# Altium schematic sheet BW1097_AV.SchDoc: =project_title
size Tabloid; CompanyName: Luxonis Holding; Organization: Luxonis Holding; Address1: 1925 Harmony Park Drive; Address2: Westminster, CO; Address3: 80234; Address4: United States; SheetNumber: 17; SheetTotal: 17
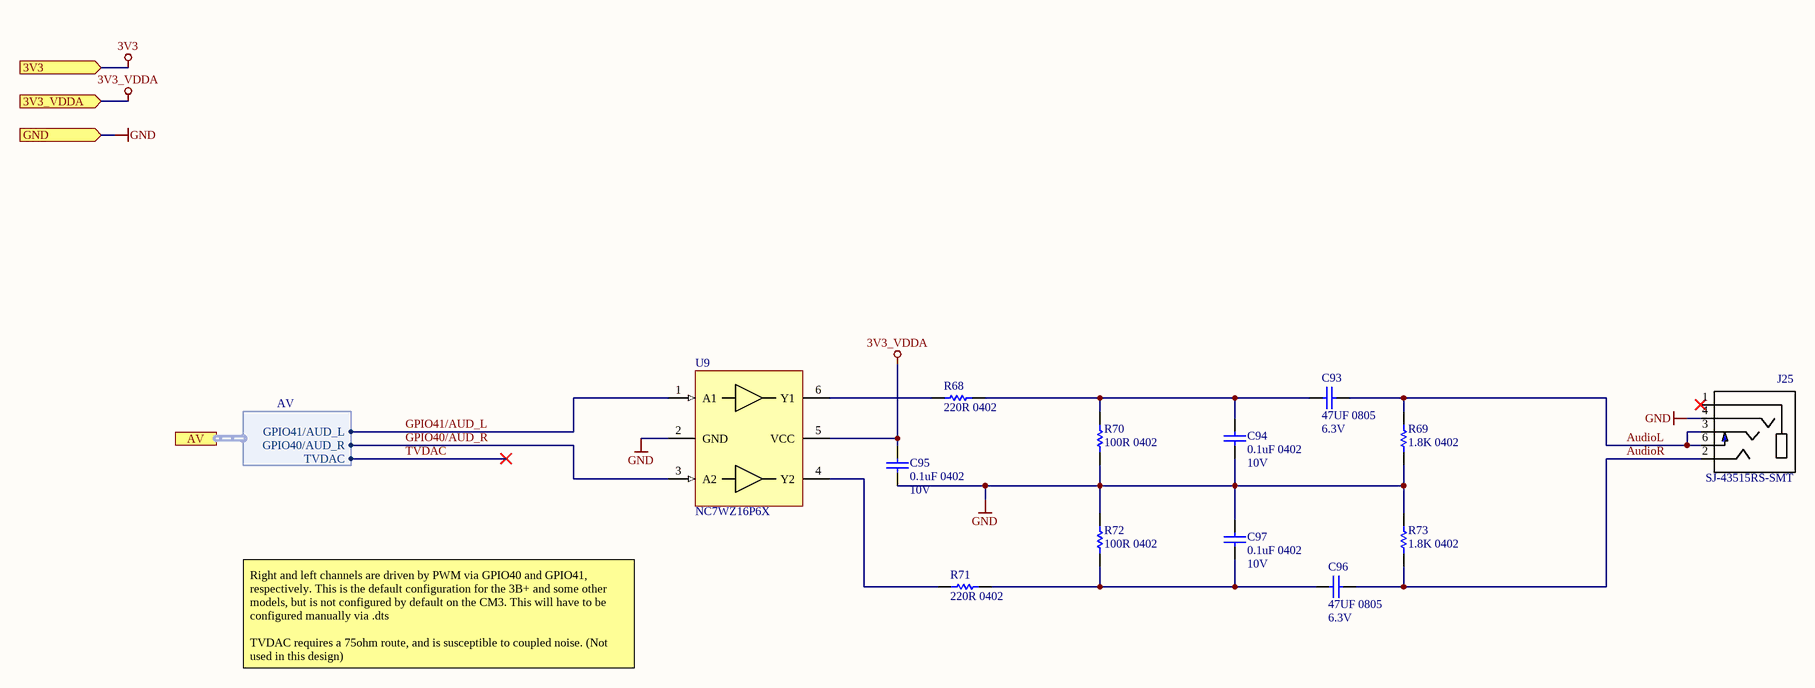
[diagram p0: BW1097_AV.SchDoc]

## Parts
C93  47UF 0805  Voltage: 6.3V  [CAPC0805(2012)145_N]
C94  0.1uF 0402  Voltage Rating: 10V  [CAPC0402(1005)70_N]
C95  0.1uF 0402  Voltage Rating: 10V  [CAPC0402(1005)70_N]
C96  47UF 0805  Voltage: 6.3V  [CAPC0805(2012)145_N]
C97  0.1uF 0402  Voltage Rating: 10V  [CAPC0402(1005)70_N]
J25  SJ-43515RS-SMT  [SJ-43515RS-SMT]
R68  220R 0402  [RESC0402(1005)_N]
R69  1.8K 0402  [RESC0402(1005)_N]
R70  100R 0402  [RESC0402(1005)_N]
R71  220R 0402  [RESC0402(1005)_N]
R72  100R 0402  [RESC0402(1005)_N]
R73  1.8K 0402  [RESC0402(1005)_N]
U9  NC7WZ16P6X  [NC7WZ16P6X]

## Ports
3V3 (in), 3V3_VDDA (in), AV (harness AV), GND (in)

## Harnesses
AV: GPIO40/AUD_R, GPIO41/AUD_L, TVDAC

## Nets
3V3: port 3V3
3V3_VDDA: C95.2 U9.5(VCC) ; port 3V3_VDDA
GND: C94.1 C95.1 C97.1 J25.4(RING2) R69.1 R70.1 R72.1 R73.1 U9.2(GND) ; port GND
AudioL: C93.1 J25.3(RING1) J25.6(RING_SWITCH) R69.2
AudioR: C96.1 J25.2(TIP) R73.2
GPIO40/AUD_R: U9.3(A2) ; port AV.GPIO40/AUD_R
GPIO41/AUD_L: U9.1(A1) ; port AV.GPIO41/AUD_L
TVDAC: port AV.TVDAC
NetC93_2: C93.2 C94.2 R68.2 R70.2
NetC96_2: C96.2 C97.2 R71.2 R72.2
NetR68_1: R68.1 U9.6(Y1)
NetR71_1: R71.1 U9.4(Y2)

Not connected (* = marked no-connect by the designer): J25 1(SLEEVE)*

## Notes on the sheet
- Right and left channels are driven by PWM via GPIO40 and GPIO41, respectively. This is the default configuration for the 3B+ and some other models, but is not configured by default on the CM3. This will have to be configured manually via .dts
  TVDAC requires a 75ohm route, and is susceptible to coupled noise. (Not used in this design)
- Title
- Size:
- Date:
- Tabloid
- Number:
- Time:
- Revision:
- Sheet
- of
- Drawn by:

## Library data of the parts
C93 C96 = GRM21BR60J476ME15L: CAP CER 47UF 6.3V X5R 0805; Manufacturer 1: Murata; Tolerance: 20%; Manufacturer Part Number 1: GRM21BR60J476ME15L; Supplier 1: Digi-Key; Stock 1: 16165; Pricing 1: 1=0.48000, 10=0.33900, 100=0.22360, 500=0.16560, 1000=0.14076 (USD); RoHS: Yes; Mount: Surface Mount; Case/Package: 0805; Weight: 0.000335oz; Case Code (Metric): 2012; Case Code (Imperial): 0805; Min Operating Temperature: -55°C; Max Operating Temperature: 85°C; Voltage Rating: 6.3V; Packaging: Tape and Reel; Capacitance: 47uF; Voltage Rating (DC): 6.3V; Package Quantity: 3000; Termination: SMD/SMT; Dielectric: X5R; Length: 2mm; Height: 1.25mm; Width: 0.049inch; Depth: 1.25mm; Thickness: 0.057inch; Lead Free: Lead Free; REACH SVHC: No SVHC; ComponentLink1URL: https://datasheet.ciiva.com/46444/1754700-46444997.pdf?src-supplier=Element14; ComponentLink1Description: https://datasheet.ciiva.com/46444/1754700-46444997.pdf?src-supplier=Element14; Supplier 2: Newark; Supplier 3: Mouser; Supplier Part Number 1: 490-9960-1-ND; Supplier Part Number 2: 40X5890; Supplier Part Number 3: 81-GRM21BR60J476ME5L
C94 C95 C97 = GRM155R71A104JA01D: CAP CER 0.1UF 10V X7R 0402 5%; Manufacturer 1: Murata; Capacitance: 100nF; Manufacturer Part Number 1: GRM155R71A104JA01D; Supplier 1: Digi-Key; Stock 1: 1346709; Pricing 1: 1=0.10000, 10=0.02500, 100=0.01130, 500=0.00806, 1000=0.00633, 2500=0.00575, 5000=0.00529 (USD); RoHS: Yes; Mount: Surface Mount; Case/Package: 0402; Case Code (Imperial): 0402; Case Code (Metric): 1005; Min Operating Temperature: -55°C; Max Operating Temperature: 125°C; Tolerance: 5%; Packaging: Tape and Reel; Voltage Rating (DC): 10V; Dielectric: X7R; Package Quantity: 10000; Termination: SMD/SMT; Length: 1mm; Height: 0.5mm; Width: 0.02inch; Thickness: 0.022inch; Depth: 0.5mm; Radiation Hardening: No; Lead Free: Lead Free; ComponentLink1URL: https://datasheet.ciiva.com/5411/product-5411135.pdf?src-supplier=Mouser; ComponentLink1Description: https://datasheet.ciiva.com/5411/product-5411135.pdf?src-supplier=Mouser; ComponentLink2URL: https://datasheet.ciiva.com/11618/c02e-11618821.pdf?src-supplier=Avnet; ComponentLink2Description: https://datasheet.ciiva.com/11618/c02e-11618821.pdf?src-supplier=Avnet; Supplier Part Number 1: 490-10777-1-ND
J25 = SJ-43515RS-SMT: CONN JACK 4COND 3.5MM SMD R/A; Manufacturer 1: CUI; Manufacturer Part Number 1: SJ-43515RS-SMT-TR; Gender: Female; Shielding: Unshielded; Number of Conductors: 4; Number of Ports: 1; Current Rating: 1A; Value: *; Supplier 1: Mouser; Stock 1: 7368; Pricing 1: 1=1.07000, 10=0.93900, 50=0.84700, 100=0.81000, 1000=0.58900, 10000=0.53400 (USD); Mount: Surface Mount; Case/Package: SMD/SMT; Color: Black; Contact Plating: Silver; Packaging: Tape and Reel; Connector Type: Jack; Orientation: Horizontal; Termination: Solder; ComponentLink1URL: https://datasheet.ciiva.com/7368/sj-4351x-smt-series-7368764.pdf?src-supplier=Digi-Key; ComponentLink1Description: https://datasheet.ciiva.com/7368/sj-4351x-smt-series-7368764.pdf?src-supplier=Digi-Key; ComponentLink2URL: https://datasheet.ciiva.com/7368/sj-4351x-smt-series-7368767.pdf?src-supplier=Digi-Key; ComponentLink2Description: https://datasheet.ciiva.com/7368/sj-4351x-smt-series-7368767.pdf?src-supplier=Digi-Key; ComponentLink3URL: http://datasheet.octopart.com/SJ-43515RS-SMT-TR-CUI-datasheet-103775270.pdf?src-supplier=CUI; ComponentLink3Description: http://datasheet.octopart.com/SJ-43515RS-SMT-TR-CUI-datasheet-103775270.pdf?src-supplier=CUI; ComponentLink4URL: http://datasheet.octopart.com/SJ-43515RS-SMT-TR-CUI-datasheet-136901581.pdf?src-supplier=CUI; ComponentLink4Description: http://datasheet.octopart.com/SJ-43515RS-SMT-TR-CUI-datasheet-136901581.pdf?src-supplier=CUI; ComponentLink5URL: http://datasheet.octopart.com/SJ-43515RS-SMT-TR-CUI-datasheet-103114024.pdf?src-supplier=Electro+Sonic; ComponentLink5Description: http://datasheet.octopart.com/SJ-43515RS-SMT-TR-CUI-datasheet-103114024.pdf?src-supplier=Electro+Sonic; ComponentLink6URL: http://datasheet.octopart.com/SJ-43515RS-SMT-TR-CUI-datasheet-13290545.pdf?src-supplier=Future+Electronics; ComponentLink6Description: http://datasheet.octopart.com/SJ-43515RS-SMT-TR-CUI-datasheet-13290545.pdf?src-supplier=Future+Electronics; ComponentLink7URL: http://datasheet.octopart.com/SJ-43515RS-SMT-TR-CUI-datasheet-102990244.pdf?src-supplier=Future+Electronics; ComponentLink7Description: http://datasheet.octopart.com/SJ-43515RS-SMT-TR-CUI-datasheet-102990244.pdf?src-supplier=Future+Electronics; ComponentLink8URL: http://datasheet.octopart.com/SJ-43515RS-SMT-TR-CUI-datasheet-103078434.pdf?src-supplier=Future+Electronics; ComponentLink8Description: http://datasheet.octopart.com/SJ-43515RS-SMT-TR-CUI-datasheet-103078434.pdf?src-supplier=Future+Electronics; Supplier Part Number 1: 490-SJ43515RS-SMT-TR
R68 R71 = RC0402FR-07220RL: RES SMD 220 OHM 1% 1/16W 0402; Manufacturer 1: Yageo; Voltage Rating: 50V; Temperature Coefficient: 100ppm/°C; Power Rating: 62.5mW; Max Power Dissipation: 63mW; Manufacturer Part Number 1: RC0402FR-07220RL; Supplier 1: Digi-Key; Stock 1: 2196434; Pricing 1: 1=0.10000, 10=0.01600, 100=0.00640, 1000=0.00289, 2500=0.00251, 5000=0.00207 (USD); RoHS: Yes; Case/Package: 0402; Number of Pins: 2; Case Code (Imperial): 0402; Case Code (Metric): 1005; Min Operating Temperature: -55°C; Max Operating Temperature: 155°C; Tolerance: 1%; Packaging: Tape and Reel; Package Quantity: 1; Termination: SMD/SMT; Resistance: 220R; Composition: Thick Film; Voltage Rating (DC): 50V; Military Standard: Not; Number of Terminations: 2; Features: Moisture Resistant; Length: 1mm; Height: 0.016inch; Width: 0.02inch; Depth: 0.5mm; REACH SVHC: No SVHC; Lead Free: Lead Free; ComponentLink1URL: https://datasheet.ciiva.com/11819/0900766b80c66297-11819466.pdf?src-supplier=RSComponents; ComponentLink1Description: https://datasheet.ciiva.com/11819/0900766b80c66297-11819466.pdf?src-supplier=RSComponents; ComponentLink2URL: https://datasheet.ciiva.com/2453/pyu-r-int-thick-7-2453460.pdf?src-supplier=Digi-Key; ComponentLink2Description: https://datasheet.ciiva.com/2453/pyu-r-int-thick-7-2453460.pdf?src-supplier=Digi-Key; ComponentLink3URL: https://datasheet.ciiva.com/2453/pyu-r-int-thick-7-2453461.pdf?src-supplier=Digi-Key; ComponentLink3Description: https://datasheet.ciiva.com/2453/pyu-r-int-thick-7-2453461.pdf?src-supplier=Digi-Key; ComponentLink4URL: https://datasheet.ciiva.com/2453/pyu-r-int-thick-7-2453462.pdf?src-supplier=Digi-Key; ComponentLink4Description: https://datasheet.ciiva.com/2453/pyu-r-int-thick-7-2453462.pdf?src-supplier=Digi-Key; ComponentLink5URL: https://datasheet.ciiva.com/16746/pyu-rc0402-51-rohs-l-6-r-16746831.pdf?src-supplier=Future+Electronics; ComponentLink5Description: https://datasheet.ciiva.com/16746/pyu-rc0402-51-rohs-l-6-r-16746831.pdf?src-supplier=Future+Electronics; Supplier 2: Mouser; Supplier Part Number 1: 311-220LRCT-ND; Supplier Part Number 2: 603-RC0402FR-07220RL
R69 R73 = RC0402FR-071K8L: RES SMD 1.8K OHM 1% 1/16W 0402; Manufacturer 1: Yageo; Resistance: 1.8kR; Temperature Coefficient: 100ppm/°C; Power Rating: 63mW; Voltage Rating: 50V; Manufacturer Part Number 1: RC0402FR-071K8L; Supplier 1: Digi-Key; Stock 1: 1041820; Pricing 1: 1=0.10000, 10=0.01600, 100=0.00640, 1000=0.00289, 2500=0.00251, 5000=0.00207 (USD); RoHS: Yes; Case/Package: 0402; Case Code (Imperial): 0402; Case Code (Metric): 1005; Min Operating Temperature: -55°C; Max Operating Temperature: 155°C; Tolerance: 1%; Packaging: Tape and Reel; Composition: Thick Film; Package Quantity: 1; Termination: SMD/SMT; Number of Terminations: 2; Max Power Dissipation: 63mW; Military Standard: Not; Features: Moisture Resistant; Working Voltage: 50V; Length: 1mm; Height: 0.016inch; Width: 0.02inch; Depth: 0.5mm; Lead Free: Lead Free; REACH SVHC: Unknown; ComponentLink1URL: https://datasheet.ciiva.com/11819/0900766b80c66297-11819472.pdf?src-supplier=RSComponents; ComponentLink1Description: https://datasheet.ciiva.com/11819/0900766b80c66297-11819472.pdf?src-supplier=RSComponents; ComponentLink2URL: https://datasheet.ciiva.com/2453/pyu-r-int-thick-7-2453530.pdf?src-supplier=Digi-Key; ComponentLink2Description: https://datasheet.ciiva.com/2453/pyu-r-int-thick-7-2453530.pdf?src-supplier=Digi-Key; ComponentLink3URL: https://datasheet.ciiva.com/7849/1018594-7849868.pdf?src-supplier=Element14; ComponentLink3Description: https://datasheet.ciiva.com/7849/1018594-7849868.pdf?src-supplier=Element14; ComponentLink4URL: https://datasheet.ciiva.com/16744/pyu-rc0402-51-rohs-l-6-r-16744223.pdf?src-supplier=Future+Electronics; ComponentLink4Description: https://datasheet.ciiva.com/16744/pyu-rc0402-51-rohs-l-6-r-16744223.pdf?src-supplier=Future+Electronics; ComponentLink5URL: https://datasheet.ciiva.com/7849/1018594-7849867.pdf?src-supplier=Element14; ComponentLink5Description: https://datasheet.ciiva.com/7849/1018594-7849867.pdf?src-supplier=Element14; ComponentLink6URL: https://datasheet.ciiva.com/12667/pyu-rc0402-51-rohs-l-6-r-12667431.pdf?src-supplier=Mouser; ComponentLink6Description: https://datasheet.ciiva.com/12667/pyu-rc0402-51-rohs-l-6-r-12667431.pdf?src-supplier=Mouser; ComponentLink7URL: https://datasheet.ciiva.com/2453/pyu-r-int-thick-7-2453529.pdf?src-supplier=Digi-Key; ComponentLink7Description: https://datasheet.ciiva.com/2453/pyu-r-int-thick-7-2453529.pdf?src-supplier=Digi-Key; ComponentLink8URL: https://datasheet.ciiva.com/2453/pyu-r-int-thick-7-2453531.pdf?src-supplier=Digi-Key; ComponentLink8Description: https://datasheet.ciiva.com/2453/pyu-r-int-thick-7-2453531.pdf?src-supplier=Digi-Key; Supplier 2: Mouser; Supplier Part Number 2: 603-RC0402FR-071K8L; Supplier Part Number 1: 311-1.80KLRCT-ND
R70 R72 = RC0402FR-07100RL: RES SMD 100 OHM 1% 1/16W 0402; Manufacturer 1: Yageo; Temperature Coefficient: 100ppm/°C; Power Rating: 62.5mW; Voltage Rating: 50V; Manufacturer Part Number 1: RC0402FR-07100RL; Supplier 1: Digi-Key; Stock 1: 45349485; Pricing 1: 1=0.10000, 10=0.01600, 100=0.00640, 1000=0.00289, 2500=0.00251, 5000=0.00207 (USD); RoHS: Yes; Case/Package: 0402; Number of Pins: 2; Case Code (Imperial): 0402; Case Code (Metric): 1005; Min Operating Temperature: -55°C; Max Operating Temperature: 155°C; Tolerance: 1%; Resistance: 100R; Packaging: Tape and Reel; Composition: Thick Film; Voltage Rating (DC): 50V; Military Standard: Not; Termination: SMD/SMT; Length: 1mm; Height: 0.32mm; Width: 0.5mm; Depth: 0.5mm; REACH SVHC: No SVHC; Lead Free: Lead Free; ComponentLink1URL: https://datasheet.ciiva.com/7849/1784430-7849810.pdf?src-supplier=Element14; ComponentLink1Description: https://datasheet.ciiva.com/7849/1784430-7849810.pdf?src-supplier=Element14; ComponentLink2URL: https://datasheet.ciiva.com/11808/0900766b80c66297-11808765.pdf?src-supplier=RSComponents; ComponentLink2Description: https://datasheet.ciiva.com/11808/0900766b80c66297-11808765.pdf?src-supplier=RSComponents; ComponentLink3URL: https://datasheet.ciiva.com/12667/pyu-rc0402-51-rohs-l-6-r-12667957.pdf?src-supplier=Mouser; ComponentLink3Description: https://datasheet.ciiva.com/12667/pyu-rc0402-51-rohs-l-6-r-12667957.pdf?src-supplier=Mouser; ComponentLink4URL: https://datasheet.ciiva.com/22747/1018594-22747511.pdf?src-supplier=Element14; ComponentLink4Description: https://datasheet.ciiva.com/22747/1018594-22747511.pdf?src-supplier=Element14; ComponentLink5URL: https://datasheet.ciiva.com/28367/1018594-28367226.pdf?src-supplier=Element14; ComponentLink5Description: https://datasheet.ciiva.com/28367/1018594-28367226.pdf?src-supplier=Element14; ComponentLink6URL: https://datasheet.ciiva.com/16740/pyu-rc0402-51-rohs-l-6-r-16740566.pdf?src-supplier=Future+Electronics; ComponentLink6Description: https://datasheet.ciiva.com/16740/pyu-rc0402-51-rohs-l-6-r-16740566.pdf?src-supplier=Future+Electronics; ComponentLink7URL: https://datasheet.ciiva.com/15189/getdatasheetpartid-329466-15189335.pdf?src-supplier=Verical; ComponentLink7Description: https://datasheet.ciiva.com/15189/getdatasheetpartid-329466-15189335.pdf?src-supplier=Verical; Supplier 2: Newark; Supplier 3: Mouser; Supplier Part Number 1: 311-100LRCT-ND; Supplier Part Number 2: 45Y6897; Supplier Part Number 3: 603-RC0402FR-07100RL
U9 = NC7WZ16P6X: IC BUF NON-INVERT 5.5V SC70-6 Buffer, Non-Inverting 2 Element 1 Bit per Element Push-Pull Output SC-88 (SC-70-6); Manufacturer 1: ON Semiconductor / Fairchild; Min Supply Voltage: 1.65V; Logic Function: Buffer,Inverting; Low Level Output Current: 32mA; High Level Output Current: -32mA; Propagation Delay: 3.8ns; Number of Elements: 2; Number of Bits per Element: 1; Max Power Dissipation: 180mW; Turn-On Delay Time: 10.6ns; Quiescent Current: 1uA; Supplier 1: Digi-Key; Manufacturer Part Number 1: NC7WZ16P6X; Stock 1: 89814; Pricing 1: 1=0.44000, 10=0.32600, 100=0.18480, 500=0.12238, 1000=0.09382 (USD); RoHS: Yes; Mount: Surface Mount; Case/Package: SC; Number of Pins: 6; Weight: 0.028g; Contact Plating: Tin,Matte; Min Operating Temperature: -40°C; Max Operating Temperature: 125°C; Max Supply Voltage: 5.5V; Packaging: Tape and Reel; Polarity: Non-Inverting; Package Quantity: 3000; Number of Input Lines: 2; Number of Output Lines: 2; Number of Channels: 2; Number of Bits: 2; Number of Inputs: 2; Number of Outputs: 2; Number of Circuits: 2; Termination: SMD/SMT; Length: 2mm; Height: 1mm; Width: 1.25mm; Radiation Hardening: No; Lead Free: Lead Free; REACH SVHC: No SVHC; ComponentLink1URL: https://datasheet.ciiva.com/5701/1725615-5701889.pdf?src-supplier=Farnell; ComponentLink1Description: https://datasheet.ciiva.com/5701/1725615-5701889.pdf?src-supplier=Farnell; ComponentLink2URL: https://datasheet.ciiva.com/15094/getdatasheetpartid-92041-15094657.pdf?src-supplier=Verical; ComponentLink2Description: https://datasheet.ciiva.com/15094/getdatasheetpartid-92041-15094657.pdf?src-supplier=Verical; ComponentLink3URL: https://datasheet.ciiva.com/27051/1028128-27051265.pdf?src-supplier=Jameco; ComponentLink3Description: https://datasheet.ciiva.com/27051/1028128-27051265.pdf?src-supplier=Jameco; ComponentLink4URL: https://datasheet.ciiva.com/8260/nc7wz16-8260101.pdf?src-supplier=Avnet; ComponentLink4Description: https://datasheet.ciiva.com/8260/nc7wz16-8260101.pdf?src-supplier=Avnet; ComponentLink5URL: https://datasheet.ciiva.com/17332/nc7wz16-17332853.pdf?src-supplier=Future+Electronics; ComponentLink5Description: https://datasheet.ciiva.com/17332/nc7wz16-17332853.pdf?src-supplier=Future+Electronics; ComponentLink6URL: https://datasheet.ciiva.com/8260/nc7wz16-8260105.pdf?src-supplier=Avnet; ComponentLink6Description: https://datasheet.ciiva.com/8260/nc7wz16-8260105.pdf?src-supplier=Avnet; ComponentLink7URL: https://datasheet.ciiva.com/26096/nc7wz16-26096508.pdf?src-supplier=Avnet+Europe; ComponentLink7Description: https://datasheet.ciiva.com/26096/nc7wz16-26096508.pdf?src-supplier=Avnet+Europe; ComponentLink8URL: https://datasheet.ciiva.com/1832/nc7wz16-1832237.pdf?src-supplier=Digi-Key; ComponentLink8Description: https://datasheet.ciiva.com/1832/nc7wz16-1832237.pdf?src-supplier=Digi-Key; ComponentLink9URL: https://datasheet.ciiva.com/7971/1725615-7971037.pdf?src-supplier=Element14; ComponentLink9Description: https://datasheet.ciiva.com/7971/1725615-7971037.pdf?src-supplier=Element14; ComponentLink10URL: https://datasheet.ciiva.com/1832/nc7wz16-1832238.pdf?src-supplier=Digi-Key; ComponentLink10Description: https://datasheet.ciiva.com/1832/nc7wz16-1832238.pdf?src-supplier=Digi-Key; ComponentLink11URL: https://datasheet.ciiva.com/1832/nc7wz16-1832239.pdf?src-supplier=Digi-Key; ComponentLink11Description: https://datasheet.ciiva.com/1832/nc7wz16-1832239.pdf?src-supplier=Digi-Key; Supplier Part Number 1: NC7WZ16P6XCT-ND